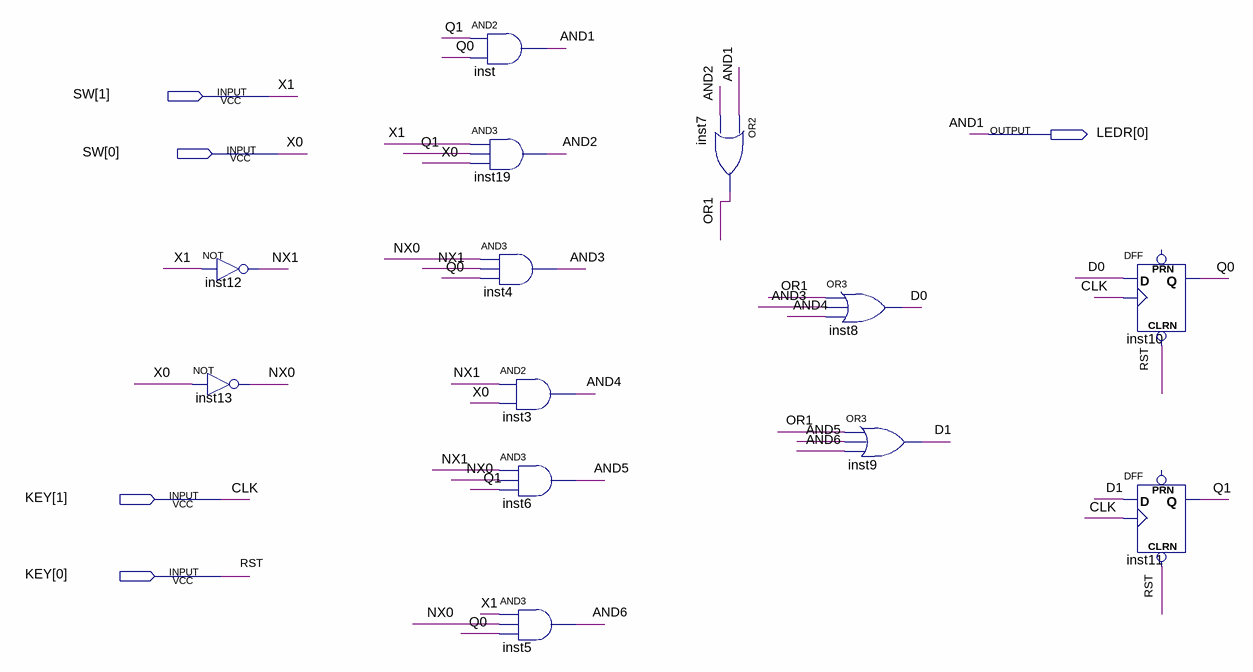
[diagram p0: schematic sheet]
// Quartus schematic projeto2.bdf as structural Verilog: 13 symbols, 5 pins
module projeto2 (
  input  [1:0] SW,
  input  [1:0] KEY,
  output [0:0] LEDR
);

  wire AND2, AND3, AND4, AND5, AND6, D0, D1, NX0, NX1, OR1, Q0, Q1;

  not inst12 (NX1, SW[1]);
  not inst13 (NX0, SW[0]);
  and inst (LEDR[0], Q1, Q0);
  and inst19 (AND2, SW[1], Q1, SW[0]);
  and inst4 (AND3, NX0, NX1, Q0);
  and inst3 (AND4, NX1, SW[0]);
  and inst6 (AND5, NX1, NX0, Q1);
  and inst5 (AND6, SW[1], NX0, Q0);
  or inst7 (OR1, LEDR[0], AND2);
  or inst8 (D0, OR1, AND3, AND4);
  or inst9 (D1, OR1, AND5, AND6);
  DFF inst10 (.CLRN(KEY[0]), .CLK(KEY[1]), .D(D0), .Q(Q0));  // open: PRN
  DFF inst11 (.CLRN(KEY[0]), .CLK(KEY[1]), .D(D1), .Q(Q1));  // open: PRN

  // Other names for the same wires on the sheet: AND1 = LEDR[0]; CLK = KEY[1]; RST = KEY[0]; X0 = SW[0]; X1 = SW[1]
endmodule
